# Altium project uz_per_current_measurement_dsub_to_rj45.PrjPcb
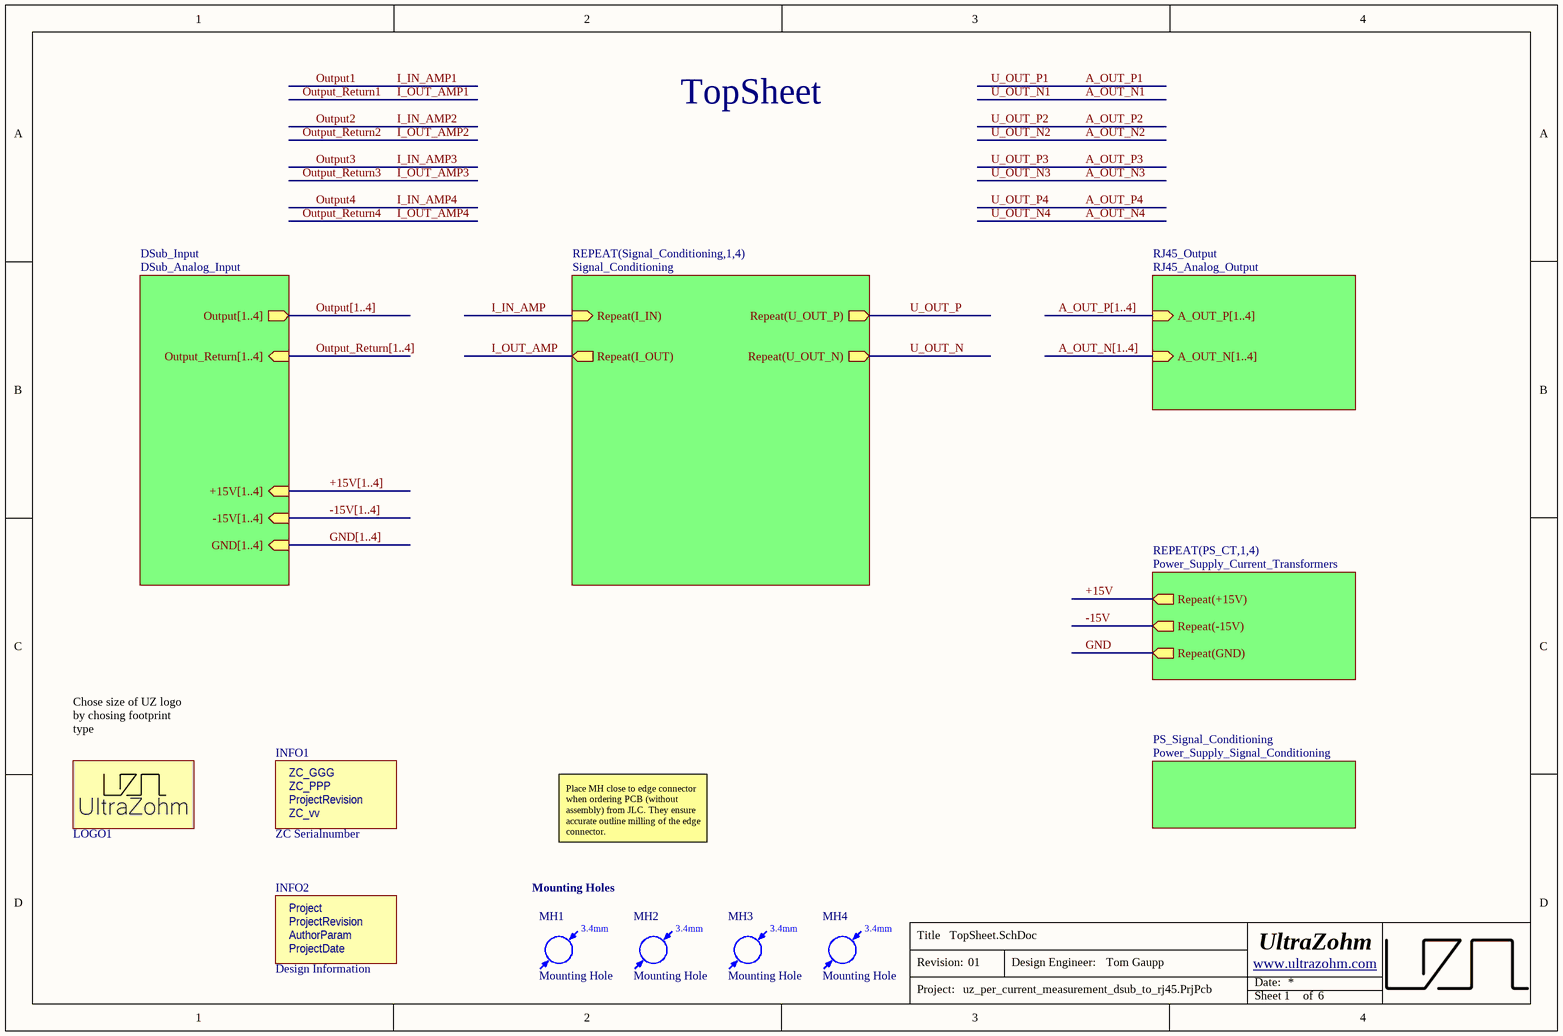
[diagram p0: TopSheet.SchDoc]
AuthorParam: Tom Gaupp; Project: uz_per_current_measurement_dsub_to_rj45; ProjectDate: 04/26; ProjectRevision: 01; ZC_GGG: 004; ZC_PPP: 008; ZC_vv: 00
6 sheets, 107 parts. Net scope: hierarchical (ports join the sheet entries above them; power ports are global).
Board file: uz_per_current_measurement_dsub_to_rj45.PcbDoc
Sheets:
  TopSheet.SchDoc
    Signal_Conditioning1 = Signal_Conditioning.SchDoc
    Signal_Conditioning2 = Signal_Conditioning.SchDoc
    Signal_Conditioning3 = Signal_Conditioning.SchDoc
    Signal_Conditioning4 = Signal_Conditioning.SchDoc
    DSub_Input = DSub_Analog_Input.SchDoc
    RJ45_Output = RJ45_Analog_Output.SchDoc
    PS_Signal_Conditioning = Power_Supply_Signal_Conditioning.SchDoc
    PS_CT1 = Power_Supply_Current_Transformers.SchDoc
    PS_CT2 = Power_Supply_Current_Transformers.SchDoc
    PS_CT3 = Power_Supply_Current_Transformers.SchDoc
    PS_CT4 = Power_Supply_Current_Transformers.SchDoc

## Sheet TopSheet.SchDoc
size A4; Author: Tom Gaupp; CompanyName: Zohm Control; Organization: UltraZohm; Address1: Kesslerplatz 12; Address2: 90489 Nürnberg; Address3: GERMANY; Revision: 1; SheetNumber: 1; SheetTotal: 6; Website: www.ultrazohm.com

### Parts
INFO1  ZC Serialnumber  [ZC-Serial]  (no BOM)
INFO2  Design Information  [Design_info]  (no BOM)
LOGO1  UZ Logo  [UZ_Logo_small]  (value not drawn)  (no BOM)
MH1  Mounting Hole  [MH_3.4]  (no BOM)
MH2  Mounting Hole  [MH_3.4]  (no BOM)
MH3  Mounting Hole  [MH_3.4]  (no BOM)
MH4  Mounting Hole  [MH_3.4]  (no BOM)

### Sub-sheets
DSub_Input = DSub_Analog_Input: Output[1..4] (out), Output_Return[1..4] (in), +15V[1..4] (in), -15V[1..4] (in), GND[1..4] (in)
PS_Signal_Conditioning = Power_Supply_Signal_Conditioning: no entries
REPEAT(PS_CT,1,4) = Power_Supply_Current_Transformers: Repeat(+15V) (out), Repeat(-15V) (out), Repeat(GND) (out)
REPEAT(Signal_Conditioning,1,4) = Signal_Conditioning: Repeat(I_IN) (in), Repeat(I_OUT) (out), Repeat(U_OUT_P) (out), Repeat(U_OUT_N) (out)
RJ45_Output = RJ45_Analog_Output: A_OUT_P[1..4] (in), A_OUT_N[1..4] (in)

### Nets
+15V: sheet REPEAT(PS_CT,1,4)/Repeat(+15V)
-15V: sheet REPEAT(PS_CT,1,4)/Repeat(-15V)
GND: sheet REPEAT(PS_CT,1,4)/Repeat(GND)
I_IN_AMP: sheet REPEAT(Signal_Conditioning,1,4)/Repeat(I_IN)
I_OUT_AMP: sheet REPEAT(Signal_Conditioning,1,4)/Repeat(I_OUT)
U_OUT_N: sheet REPEAT(Signal_Conditioning,1,4)/Repeat(U_OUT_N)
U_OUT_P: sheet REPEAT(Signal_Conditioning,1,4)/Repeat(U_OUT_P)

### Buses and harness runs
bus +15V[1..4] = sheet DSub_Input/+15V[1..4]
bus -15V[1..4] = sheet DSub_Input/-15V[1..4]
bus A_OUT_N[1..4] = sheet RJ45_Output/A_OUT_N[1..4]
bus A_OUT_P[1..4] = sheet RJ45_Output/A_OUT_P[1..4]
bus GND[1..4] = sheet DSub_Input/GND[1..4]
bus Output[1..4] = sheet DSub_Input/Output[1..4]
bus Output_Return[1..4] = sheet DSub_Input/Output_Return[1..4]

### Notes on the sheet
- TopSheet
- (near LOGO1) Chose size of UZ logo by chosing footprint type
- Place MH close to edge connector when ordering PCB (without assembly) from JLC. They ensure accurate outline milling of the edge connector.
- Mounting Holes
- Title
- Revision:
- Design Engineer:
- Date:
- Project:
- Sheet
- of
- (in symbol Design Information) Project; ProjectRevision; AuthorParam; ProjectDate
- (in symbol Mounting Hole) 3.4mm
- (in symbol ZC-Serial) ZC_GGG; ZC_PPP; ProjectRevision; ZC_vv

### Library data of the parts
INFO1 = ZC-Serial: Manufacturer: UltraZohm; Value: GGG-PPP-VVvv; Created from: FRosner; Manufacturer Part Number: ZC-Serial; PartID: 58; Created On: 15/04/2025 09:17:14; ComponentLink1Description: https://docs.ultrazohm.com/; ComponentLink1URL: homepage; Component Type: ZC Serialnumber; Last Updated: 15/04/2025 09:17:14; Supplier 1: -; Supplier Part Number 1: -; Type: Serial Number; Live Cycle Status: 1
INFO2 = Design Information: Manufacturer: UltraZohm; Created from: MGremer; Manufacturer Part Number: Design Information; PartID: 12; Created On: 03/11/2021 09:04:23; ComponentLink1Description: https://docs.ultrazohm.com/; ComponentLink1URL: homepage; Component Type: Design Information; Last Updated: 15/04/2025 09:29:36; Supplier 1: -; Supplier Part Number 1: -; Type: Design Information; Value: Design Information; Live Cycle Status: 1
LOGO1 = 1: Official Project Logo of the UltraZohm; Manufacturer: PCB Manufacturer; Manufacturer Part Number: UltraZohm Logo; Created from: T. Wendt; PartID: 1; Created On: 19.02.2021 16:55:56; ComponentLink1Description: Homepage; ComponentLink1URL: https://ultrazohm.com; Component Type: Logo; Last Updated: 02.03.2021 14:31:24; Type: Standard (No BOM); Live Cycle Status: 1
MH1-MH4 = Mounting Hole: Created from: MHlatky; Manufacturer Part Number: Mounting Hole; PartID: 16; Created On: 26/01/2021 09:19:51; ComponentLink1Description: Datasheet; Component Type: Mounting Hole; Device Package: -; Last Updated: 21/03/2022 23:05:12; Manufacturer: Mounting Hole; Supplier 1: Mounting Hole; Supplier Part Number 1: Mounting Hole; Type: Mounting Hole; Value: Mounting Hole; Live Cycle Status: 1; Stock number: not stored

## Sheet Signal_Conditioning.SchDoc
size A4; Author: Tom Gaupp; CompanyName: Technische Hochschule Nürnberg Georg Simon Ohm; Organization: UltraZohm; Address1: Kesslerplatz 12; Address2: 90489 Nürnberg; Address3: GERMANY; SheetNumber: 2; SheetTotal: 6; Website: www.ultrazohm.com
Used 4 times, as channels Signal_Conditioning1, Signal_Conditioning2, Signal_Conditioning3, Signal_Conditioning4. Parts and nets are listed once, with the designators drawn on the sheet.
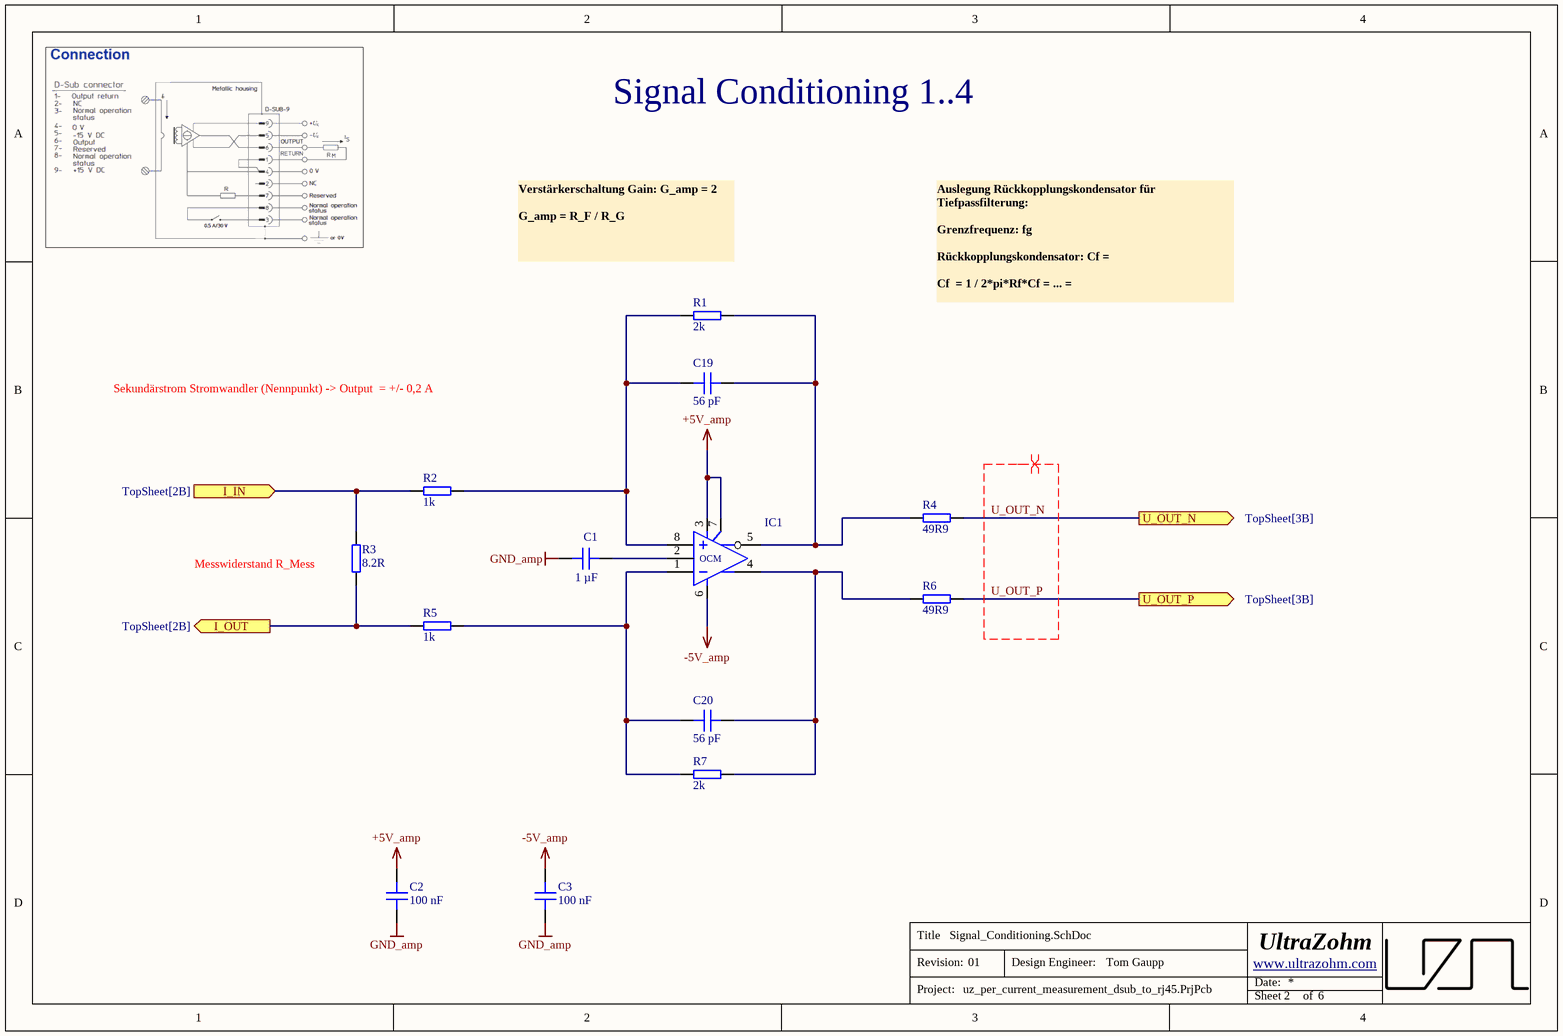
[diagram p1: Signal_Conditioning.SchDoc]

### Parts
C1  1 µF  [C_0603]
C2  100 nF  [C_0603]
C3  100 nF  [C_0603]
C19  56 pF  [C_0603]
C20  56 pF  [C_0603]
IC1  ADA4940-1ARZ-R7  [SOIC-8-N]  (value not drawn)
R1  2k  [RES 1206_3216]
R2  1k  [RES 1206_3216]
R3  8.2R  [RES 2010_5025]
R4  49R9  [RES 0603_1608]
R5  1k  [RES 1206_3216]
R6  49R9  [RES 0603_1608]
R7  2k  [RES 1206_3216]

### Ports
I_IN (in, see TopSheet[2B]), I_OUT (out, see TopSheet[2B]), U_OUT_N (out, see TopSheet[3B]), U_OUT_P (out, see TopSheet[3B])

### Nets
+5V_amp: C2.2 IC1.3(V+) IC1.7(EN)
-5V_amp: C3.2 IC1.6(V-)
GND_amp: C1.1 C2.1 C3.1
I_IN: R2.1 R3.2 ; port I_IN
I_OUT: R3.1 R5.1 ; port I_OUT
U_OUT_N: R4.2 ; port U_OUT_N
U_OUT_P: R6.2 ; port U_OUT_P
NetC1_2: C1.2 IC1.2(OCM)
NetC19_1: C19.1 IC1.8(+) R1.1 R2.2
NetC19_2: C19.2 IC1.5(Out) R1.2 R4.1
NetC20_1: C20.1 IC1.1(-) R5.2 R7.1
NetC20_2: C20.2 IC1.4(Out) R6.1 R7.2

### Channels
Signal_Conditioning1: designators C1=C1_Signal_Conditioning1 C2=C2_A C3=C3_A C19=C19_Signal_Conditioning1 C20=C20_Signal_Conditioning1 IC1=IC1_Signal_Conditioning1 R1=R1_Signal_Conditioning1 R2=R2_Signal_Conditioning1 R3=R3_A R4=R4_Signal_Conditioning1 R5=R5_Signal_Conditioning1 R6=R6_Signal_Conditioning1 R7=R7_Signal_Conditioning1; ports I_IN=I_IN_AMP1 I_OUT=I_OUT_AMP1 U_OUT_N=A_OUT_N1 U_OUT_P=A_OUT_P1
Signal_Conditioning2: designators C1=C1_Signal_Conditioning2 C2=C2_B C3=C3_B C19=C19_Signal_Conditioning2 C20=C20_Signal_Conditioning2 IC1=IC1_Signal_Conditioning2 R1=R1_Signal_Conditioning2 R2=R2_Signal_Conditioning2 R3=R3_B R4=R4_Signal_Conditioning2 R5=R5_Signal_Conditioning2 R6=R6_Signal_Conditioning2 R7=R7_Signal_Conditioning2; ports I_IN=I_IN_AMP2 I_OUT=I_OUT_AMP2 U_OUT_N=A_OUT_N2 U_OUT_P=A_OUT_P2
Signal_Conditioning3: designators C1=C1_Signal_Conditioning3 C2=C2_C C3=C3_C C19=C19_Signal_Conditioning3 C20=C20_Signal_Conditioning3 IC1=IC1_Signal_Conditioning3 R1=R1_Signal_Conditioning3 R2=R2_Signal_Conditioning3 R3=R3_C R4=R4_Signal_Conditioning3 R5=R5_Signal_Conditioning3 R6=R6_Signal_Conditioning3 R7=R7_Signal_Conditioning3; ports I_IN=I_IN_AMP3 I_OUT=I_OUT_AMP3 U_OUT_N=A_OUT_N3 U_OUT_P=A_OUT_P3
Signal_Conditioning4: designators C1=C1_Signal_Conditioning4 C2=C2_D C3=C3_D C19=C19_Signal_Conditioning4 C20=C20_Signal_Conditioning4 IC1=IC1_Signal_Conditioning4 R1=R1_Signal_Conditioning4 R2=R2_Signal_Conditioning4 R3=R3_D R4=R4_Signal_Conditioning4 R5=R5_Signal_Conditioning4 R6=R6_Signal_Conditioning4 R7=R7_Signal_Conditioning4; ports I_IN=I_IN_AMP4 I_OUT=I_OUT_AMP4 U_OUT_N=A_OUT_N4 U_OUT_P=A_OUT_P4

### Layout directives
differential pair: U_OUT_N, U_OUT_P

### Notes on the sheet
- Signal Conditioning 1..4
- Verstärkerschaltung Gain: G_amp = 2
  G_amp = R_F / R_G
- Auslegung Rückkopplungskondensator für Tiefpassfilterung:
  Grenzfrequenz: fg
  Rückkopplungskondensator: Cf =
  Cf  = 1 / 2*pi*Rf*Cf = ... =
- Sekundärstrom Stromwandler (Nennpunkt) -> Output  = +/- 0,2 A
- (near R3) Messwiderstand R_Mess
- Title
- Revision:
- Design Engineer:
- Date:
- Project:
- Sheet
- of

### Library data of the parts
C1 = CL10A105KB8NNNC: 50V 1uF X5R ±10% 0603  Multilayer Ceramic Capacitors MLCC - SMD/SMT ROHS; Manufacturer: Samsung Electro-Mechanics; Voltage Rating: 50 VDC; Created from: MGremer; Supplier 1: LCSC; Supplier Part Number 1: C15849; Manufacturer Part Number: CL10A105KB8NNNC; Value: 1 µF; PartID: 5; Created On: 20/12/2020 13:54:13; ComponentLink1Description: Datasheet; ComponentLink1URL: https://datasheet.lcsc.com/lcsc/1810261812_Samsung-Electro-Mechanics-CL10A105KB8NNNC_C15849.pdf; Component Type: Capacitor 0603; Device Package: 0603; Last Updated: 28/11/2022 17:23:01; Mounting Type: SMD; Operating Temperature: -55 - 85°C; Series: M; Type: Capacitor; Tolerance: 10 %; Live Cycle Status: 1; LCSC Part Number: C15849; Stock number: Labor SMD Container
C2 C3 = C0603C104K5RAC3121: Capacitor 0603, 50 VDC, 100nF, X7R; Manufacturer: KEMET; Tolerance: 10 %; Voltage Rating: 50 VDC; Created from: DHufnagel; Manufacturer Part Number: C0603C104K5RAC3121; PartID: 99; Created On: 11/08/2022 14:33:29; ComponentLink1Description: Datasheet; ComponentLink1URL: https://www.mouser.de/datasheet/2/212/KEM_C1023_X7R_AUTO_SMD-1093309.pdf; Component Type: Capacitor 0603; Device Package: 0603; Last Updated: 19/08/2022 08:26:58; Mounting Type: SMD; Operating Temperature: -55 - 125°C; Series: X7R; Supplier 1: Mouser; Supplier Part Number 1: 80-C603C104K5RAC3121; Supplier 2: LCSC; Supplier Part Number 2: C696358; Type: Capacitor; Value: 100 nF; Live Cycle Status: 1; LCSC Part Number: C696358; Stock number: not stored
C19 C20 = CL10C560JB8NNNC: Capacitor 0603, 50 VDC, 56 pF, C0G; Manufacturer: Samsung Electro-Mechanics; Tolerance: 5 %; Voltage Rating: 50 VDC; Created from: DHufnagel; Manufacturer Part Number: CL10C560JB8NNNC; PartID: 92; Created On: 20/12/2020 13:54:13; ComponentLink1Description: Datasheet; ComponentLink1URL: https://www.mouser.de/datasheet/2/585/MLCC-1837944.pdf; Component Type: Capacitor 0603; Device Package: 0603; Last Updated: 20/12/2020 16:24:16; Mounting Type: SMD; Operating Temperature: -55 - 125°C; Series: CL; Supplier 1: Mouser; Supplier Part Number 1: 187-CL10C560JB8NNNC; Supplier 2: LCSC; Supplier Part Number 2: C39148; Type: Capacitor; Value: 56 pF; Live Cycle Status: 1; LCSC Part Number: C39148; Stock number: not stored
IC1 = ADA4940-1ARZ-R7: Differential ADC Driver; Manufacturer: Analog Devices; Class I: Analog; Class II: Fully Differential ADC Drivers (-40-125°C); Best.-Nr.: Farnell 209-6178; Channels: 1; Created from: MGremer; Datasheet: DSO11449, Ver. Aug 2000; Last edited: 04.01.2007 10:14; Package Reference: SOIC-N-8; Manufacturer Part Number: ADA4940-1ARZ-R7; PartID: 3; Created On: 15/01/2021 12:16:53; ComponentLink1Description: Datasheet; ComponentLink1URL: https://www.mouser.de/datasheet/2/609/ADA4940-1_4940-2-878284.pdf; Component Type: ADC; Device Package: SOIC-8; Last Updated: 17/02/2026 13:51:19; Mounting Type: SMD; Operating Temperature: -40 - 105 °C; Supplier 1: Mouser; Supplier Part Number 1: 584-ADA4940-1ARZ-R7; Supplier 2: LCSC; Supplier Part Number 2: C730049; Type: ADC; Resolution: -; Value: differential ADC driver; Live Cycle Status: 1; LCSC Part Number: C730049; Stock number: not stored
R1 R7 = ERA-8AEB202V: 2kΩ ±0.1% 250mW 1206; Manufacturer: Panasonic; Created from: TGaupp; Manufacturer Part Number: ERA-8AEB202V; PartID: 384; Created On: 17/02/2026 13:38:22; ComponentLink1Description: Datasheet; ComponentLink1URL: https://www.lcsc.com/datasheet/C2073471.pdf; Component Type: SMD resistor; Device Package: 1206; Last Updated: 17/02/2026 13:39:41; Mounting Type: SMD; Supplier 1: Mouser; Supplier Part Number 1: 667-ERA-8AEB202V; Supplier 2: LCSC; Supplier Part Number 2: C2073471; Type: Resistor; Tolerance: 0.1%; Value: 2k; Live Cycle Status: 1; Stock number: not stored; LCSC Part Number: C2073471
R2 R5 = ERA-8AEB102V: SMD resistor 1/4W 1.0Kohm 0.1% 25ppm; Manufacturer: Panasonic; Created from: TGaupp; Manufacturer Part Number: ERA-8AEB102V; PartID: 292; Created On: 08/08/2023 13:03:51; ComponentLink1Description: Datasheet; ComponentLink1URL: https://www.mouser.de/datasheet/2/315/AOA0000C307-1149632.pdf; Component Type: SMD resistor; Device Package: 1206; Last Updated: 17/02/2026 13:14:39; Mounting Type: SMD; Supplier 1: Mouser; Supplier Part Number 1: 667-ERA-8AEB102V; Type: Resistor; Tolerance: 0.1%; Value: 1k; Live Cycle Status: 1; Stock number: not stored; LCSC Part Number: C491153
R3 = RC2010FK-078R2L: -55℃~+155℃ 200V 750mW 8.2Ω Thick Film Resistor ±1% ±200ppm/℃ 2010 Chip Resistor; Manufacturer: YAEGO; Created from: TGaupp; Manufacturer Part Number: RC2010FK-078R2L; PartID: 393; Created On: 03/06/2026 12:29:37; ComponentLink1Description: Datasheet; ComponentLink1URL: https://www.lcsc.com/datasheet/C877647.pdf?spm=wm.sxq.inf.ggs___wm.fly.bg.1.xh&lcsc_vid=QQAPVAECQgdWVlZeR1YKVFcAFllaVVcHTlRZAgUCQFkxVlNeR1VZUlNUTlJbUDsOAxUeFF5JWBYZEEoKFBINSQcJGk4eFQsCAgIaSgADAwAHC0slTldYV1ZfWQkaCgg%3D; Component Type: SMD resistor; Device Package: 2010; Last Updated: 03/06/2026 13:37:55; Mounting Type: SMD; Supplier 1: LCSC; Supplier Part Number 1: C877647; Type: Resistor; Tolerance: 1%; Value: 8.2R; Live Cycle Status: 1; LCSC Part Number: C877647
R4 R6 = RC0603FR-0749R9L: 100mW Thick Film Resistors ±100ppm/℃ ±1% 49.9Ω 0603 Chip Resistor - Surface Mount ROHS; Manufacturer: YAGEO; Created from: AGeiger; Manufacturer Part Number: RC0603FR-0749R9L; PartID: 277; Created On: 14.06.2023 17:42:26; ComponentLink1Description: Datasheet; ComponentLink1URL: https://datasheet.lcsc.com/lcsc/2304140030_YAGEO-RC0603FR-0749R9L_C114625.pdf; Component Type: SMD resistor; Device Package: 0603; Last Updated: 14.06.2023 17:42:26; Mounting Type: SMD; Type: Resistor; Tolerance: 1%; Value: 49R9; Live Cycle Status: 1; LCSC Part Number: C114625; Supplier 1: Mouser; Supplier Part Number 1: 603-RC0402FR-0749R9L

## Sheet DSub_Analog_Input.SchDoc
size A4; Author: Tom Gaupp; CompanyName: Technische Hochschule Nürnberg Georg Simon Ohm; Organization: UltraZohm; Address1: Kesslerplatz 12; Address2: 90489 Nürnberg; Address3: GERMANY; SheetNumber: 3; SheetTotal: 6; Website: www.ultrazohm.com
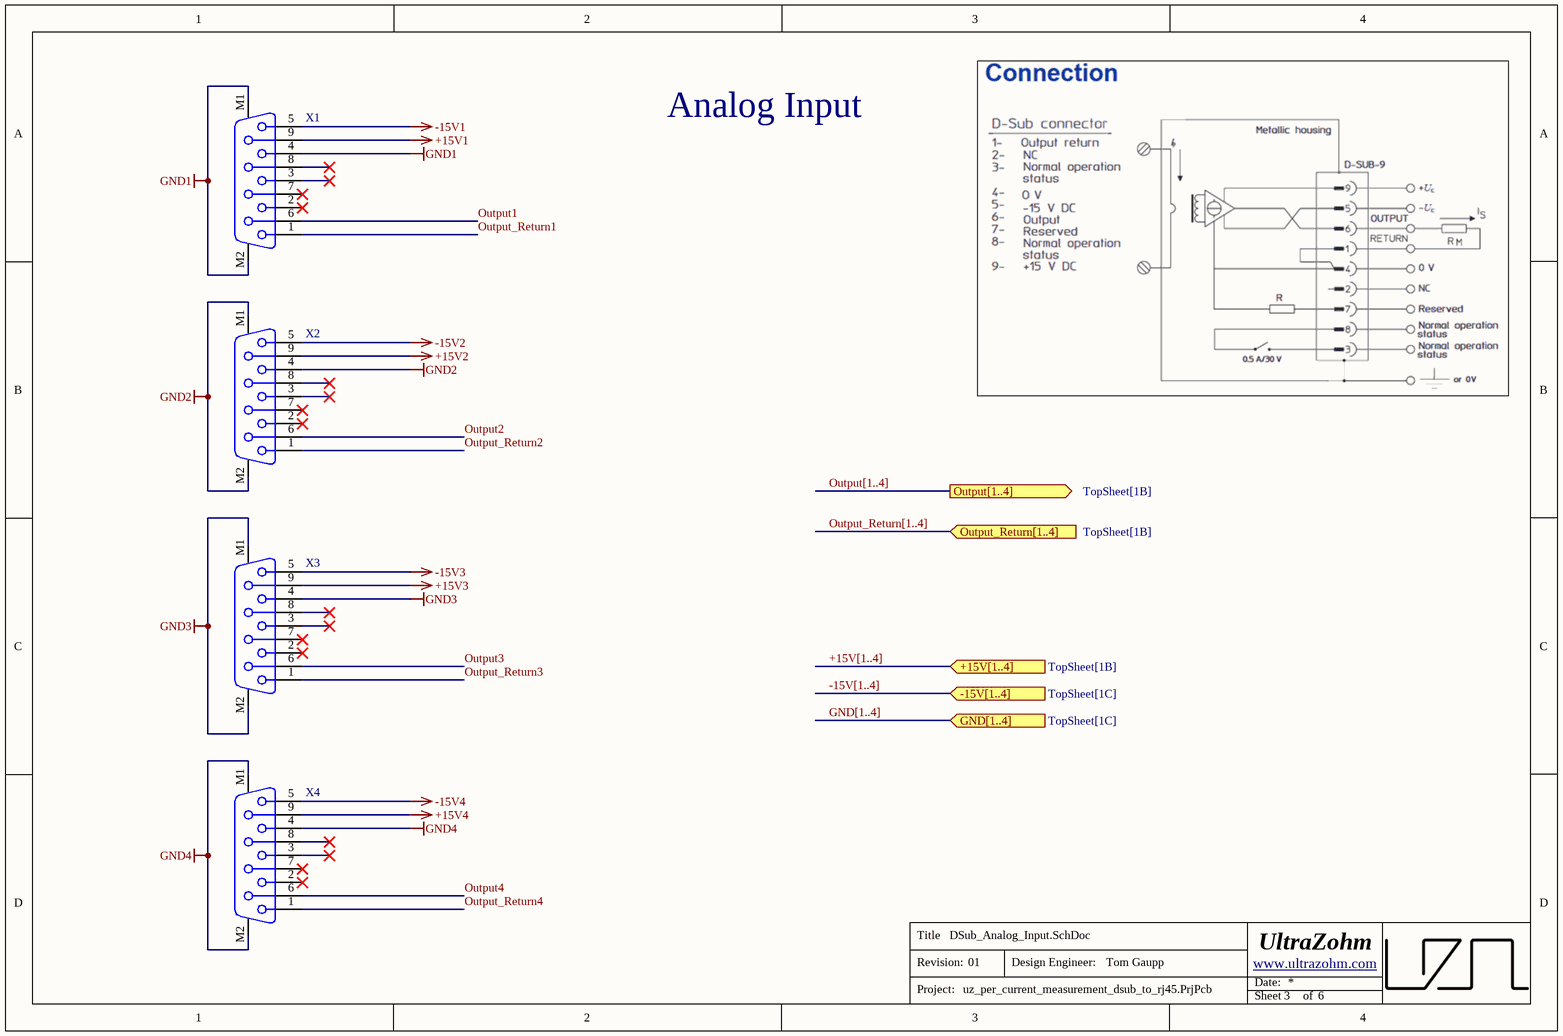
[diagram p2: DSub_Analog_Input.SchDoc]

### Parts
X1  D-SUB 9, female  [618009231121]  (value not drawn)
X2  D-SUB 9, female  [618009231121]  (value not drawn)
X3  D-SUB 9, female  [618009231121]  (value not drawn)
X4  D-SUB 9, female  [618009231121]  (value not drawn)

### Ports
+15V[1..4] (in, see TopSheet[1B]), -15V[1..4] (in, see TopSheet[1C]), GND[1..4] (in, see TopSheet[1C]), Output[1..4] (out, see TopSheet[1B]), Output_Return[1..4] (in, see TopSheet[1B])

### Nets
+15V1: X1.9
+15V2: X2.9
+15V3: X3.9
+15V4: X4.9
-15V1: X1.5
-15V2: X2.5
-15V3: X3.5
-15V4: X4.5
GND1: X1.4 X1.M1 X1.M2
GND2: X2.4 X2.M1 X2.M2
GND3: X3.4 X3.M1 X3.M2
GND4: X4.4 X4.M1 X4.M2
Output1: X1.6  [project net I_IN_AMP1]
Output2: X2.6  [project net I_IN_AMP2]
Output3: X3.6  [project net I_IN_AMP3]
Output4: X4.6  [project net I_IN_AMP4]
Output_Return1: X1.1  [project net I_OUT_AMP1]
Output_Return2: X2.1  [project net I_OUT_AMP2]
Output_Return3: X3.1  [project net I_OUT_AMP3]
Output_Return4: X4.1  [project net I_OUT_AMP4]

Not connected (* = marked no-connect by the designer): X1 2* 3* 7* 8*; X2 2* 3* 7* 8*; X3 2* 3* 7* 8*; X4 2* 3* 7* 8*

### Buses and harness runs
bus +15V[1..4] = port +15V[1..4]
bus -15V[1..4] = port -15V[1..4]
bus GND[1..4] = port GND[1..4]
bus Output[1..4] = port Output[1..4]
bus Output_Return[1..4] = port Output_Return[1..4]

### Notes on the sheet
- Analog Input
- Title
- Revision:
- Design Engineer:
- Date:
- Project:
- Sheet
- of

### Library data of the parts
X1-X4 = 618009231121: D-Sub Standard Connectors WR-DSUB Female PCB 9Pin Hex Scrw 8.08mm; Manufacturer: Wuerth Elektronik; Contact Resistance: 30mOhm; Rated Current: 3A; Working Voltage: 125VAC; Withstanding Voltage: 1000VAC; Created from: AGeiger; Manufacturer Part Number: 618009231121; Category: Input/Output Connectors; Match Code: WR-DSUB; ComponentLink1Description: Datasheet; ComponentLink1URL: https://www.we-online.com/components/products/datasheet/618009231121.pdf; ComponentLink2Description: Datasheet Link; ComponentLink2URL: https://www.we-online.com/redexpert/spec/618009231121?ad; Mount: Through Hole; Operating Temperature Max: 105°C; Operating Temperature Min: -55°C; Packaging: Tray; Gender: Female; Number of Pins: 9; Orientation: Angled; PartID: 6; Created On: 31/05/2023 13:23:16; Last Updated: 31/05/2023 13:23:16; Mounting Type: THT; Operating Temperature: -40 °C to +85 °C; Series: D-SUB Standard; Supplier 1: Mouser; Supplier Part Number 1: 710-618009231121; Value: D-SUB 9, female; LCSC Part Number: C141882

## Sheet RJ45_Analog_Output.SchDoc
size A4; Author: Tom Gaupp; CompanyName: Technische Hochschule Nürnberg Georg Simon Ohm; Organization: UltraZohm; Address1: Kesslerplatz 12; Address2: 90489 Nürnberg; Address3: GERMANY; SheetNumber: 4; SheetTotal: 6; Website: www.ultrazohm.com
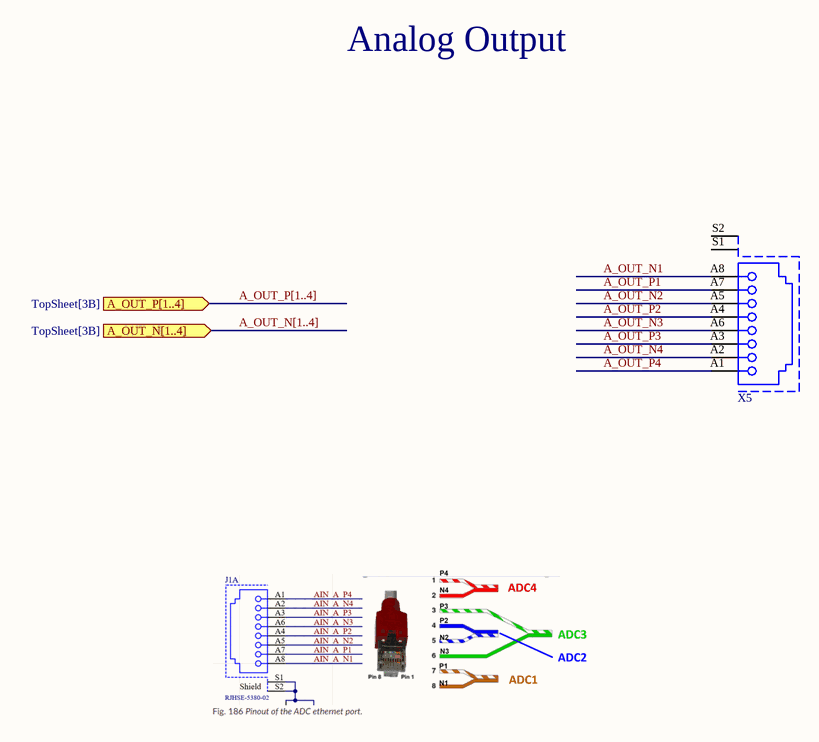
[diagram p3: RJ45_Analog_Output.SchDoc]

### Parts
X5  (no value)  [R-RJ45R10P-B000]

### Ports
A_OUT_N[1..4] (in, see TopSheet[3B]), A_OUT_P[1..4] (in, see TopSheet[3B])

### Nets
A_OUT_N1: X5.A8
A_OUT_N2: X5.A5
A_OUT_N3: X5.A6
A_OUT_N4: X5.A2
A_OUT_P1: X5.A7
A_OUT_P2: X5.A4
A_OUT_P3: X5.A3
A_OUT_P4: X5.A1

Not connected (* = marked no-connect by the designer): X5 S1 S2

### Buses and harness runs
bus A_OUT_N[1..4] = port A_OUT_N[1..4]
bus A_OUT_P[1..4] = port A_OUT_P[1..4]

### Notes on the sheet
- Analog Output
- Title
- Revision:
- Design Engineer:
- Date:
- Project:
- Sheet
- of

### Library data of the parts
X5 = R-RJ45R10P-B000: RJ45Receptacle 1 Shielded Bend insert Without LED 0℃~+70℃ Plugin Ethernet Connectors / Modular Connectors (RJ45 RJ11) ROHS; Manufacturer: Ckmtw(Shenzhen Cankemeng); Created from: KIlhan; Manufacturer Part Number: R-RJ45R10P-B000; PartID: 57; Created On: 20/03/2025 09:19:07; ComponentLink1Description: Datasheet; ComponentLink1URL: https://jlcpcb.com/api/file/downloadByFileSystemAccessId/8588892085580021760; Last Updated: 18/05/2025 18:44:47; Mounting Type: THT; Operating Temperature: 0 °C to +70 °C; Series: RJ45; Supplier 1: LCSC; Supplier Part Number 1: C386758; Value: R-RJ45R10P-B000; LCSC Part Number: C386758

## Sheet Power_Supply_Signal_Conditioning.SchDoc
size A4; Author: Tom Gaupp; CompanyName: Technische Hochschule Nürnberg Georg Simon Ohm; Organization: UltraZohm; Address1: Kesslerplatz 12; Address2: 90489 Nürnberg; Address3: GERMANY; SheetNumber: 5; SheetTotal: 6; Website: www.ultrazohm.com
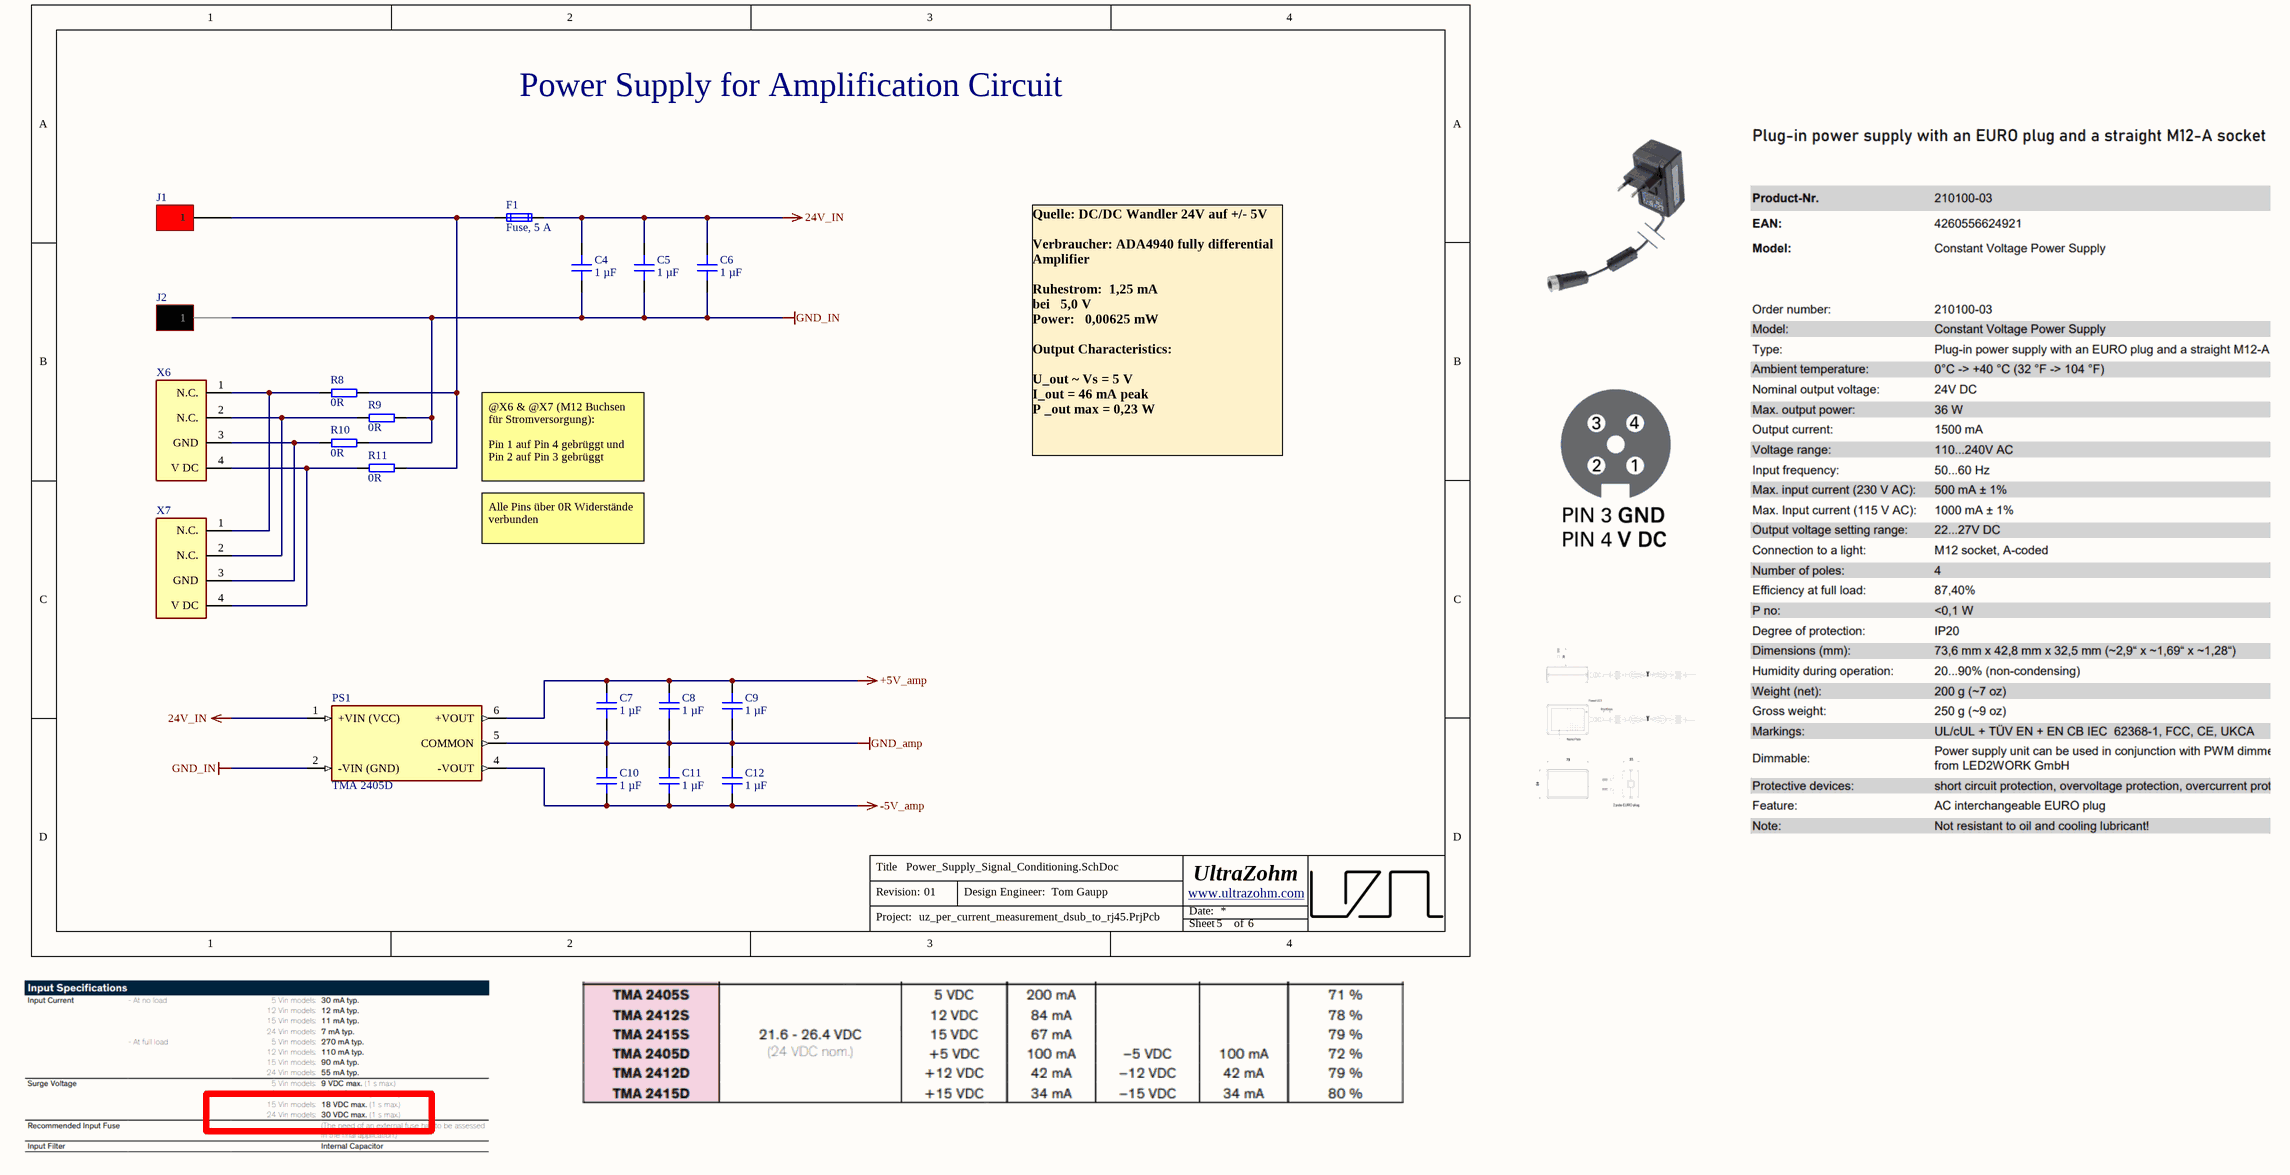
[diagram p4: Power_Supply_Signal_Conditioning.SchDoc]

### Parts
C4  1 µF  [C_0603]
C5  1 µF  [C_0603]
C6  1 µF  [C_0603]
C7  1 µF  [C_0603]
C8  1 µF  [C_0603]
C9  1 µF  [C_0603]
C10  1 µF  [C_0603]
C11  1 µF  [C_0603]
C12  1 µF  [C_0603]
F1  Fuse, 5 A  [0154xxx]
J1  FCR7350R, PCB mount 4mm jack, RED  [FCR7350]  (value not drawn)
J2  FCR7350B, PCB mount 4mm jack, BLACK  [FCR7350]  (value not drawn)
PS1  TMA 2405D  [SIP7]
R8  0R  [RES 1206_3216]
R9  0R  [RES 1206_3216]
R10  0R  [RES 1206_3216]
R11  0R  [RES 1206_3216]
X6  CAZN_M12-P4A-GPL_M12  [CAZN_M12-P4A-GPL_M12]  (value not drawn)
X7  CAZN_M12-P4A-GPL_M12  [CAZN_M12-P4A-GPL_M12]  (value not drawn)

### Nets
24V_IN: C4.1 C5.1 C6.1 F1.2 PS1.1(+VIN_(VCC))
+5V_amp: C7.2 C8.2 C9.2 PS1.6(+VOUT)
-5V_amp: C10.1 C11.1 C12.1 PS1.4(-VOUT)
GND_amp: C7.1 C8.1 C9.1 C10.2 C11.2 C12.2 PS1.5(COMMON)
GND_IN: C4.2 C5.2 C6.2 J2.1 PS1.2(-VIN_(GND)) R9.2 R10.2
NetF1_1: F1.1 J1.1 R8.2 R11.2
NetR8_1: R8.1 X6.1(N.C.) X7.1(N.C.)
NetR9_1: R9.1 X6.2(N.C.) X7.2(N.C.)
NetR10_1: R10.1 X6.3(GND) X7.3(GND)
NetR11_1: R11.1 X6.4(V_DC) X7.4(V_DC)

### Notes on the sheet
- Power Supply for Amplification Circuit
- @X6 & @X7 (M12 Buchsen für Stromversorgung):
  Pin 1 auf Pin 4 gebrüggt und
  Pin 2 auf Pin 3 gebrüggt
- Quelle: DC/DC Wandler 24V auf +/- 5V
  Verbraucher: ADA4940 fully differential Amplifier
  Ruhestrom: 	1,25 mA
  bei 		5,0 V
  Power: 		0,00625 mW
  Output Characteristics:
  U_out ~ Vs = 5 V
  I_out = 46 mA peak
  P _out max = 0,23 W
- Alle Pins über 0R Widerstände verbunden
- Title
- Revision:
- Design Engineer:
- Date:
- Project:
- Sheet
- of

### Library data of the parts
C4-C12 = CL10A105KB8NNNC: as C1 on sheet Signal_Conditioning; Supplier 1: LCSC; Supplier Part Number 1: C15849; Manufacturer Part Number: CL10A105KB8NNNC; Value: 1 µF; PartID: 5; ComponentLink1Description: Datasheet; ComponentLink1URL: https://datasheet.lcsc.com/lcsc/1810261812_Samsung-Electro-Mechanics-CL10A105KB8NNNC_C15849.pdf; Component Type: Capacitor 0603; Device Package: 0603; Mounting Type: SMD; Operating Temperature: -55 - 85°C; Series: M; Type: Capacitor; Tolerance: 10 %; Live Cycle Status: 1; LCSC Part Number: C15849; Stock number: Labor SMD Container
  C4 C5 C7-C12: Created On: 20.12.2020 13:54:13; Last Updated: 28.11.2022 17:23:01
  C6: Created On: 20/12/2020 13:54:13; Last Updated: 28/11/2022 17:23:01
F1 = 0154005.DR: Fuse OMNI BLOK 154; Manufacturer: Littlefuse; Nominal current: 5 A; Nominal voltage AC: 125 VAC; Nominal voltage DC: 125 VDC; Resistance: 12.5 mOhm; Created from: MGremer; Manufacturer Part Number: 0154005.DR; PartID: 1; Created On: 07/01/2021 10:17:19; ComponentLink1Description: Datasheet; ComponentLink1URL: https://www.mouser.de/datasheet/2/240/Littelfuse_Fuse_154_154T_154L_154TL_Datasheet_pdf-365375.pdf; Component Type: NAN02 - 154 OMNI-BLOK; Device Package: OMNI-BLOK; Last Updated: 12/08/2025 20:50:24; Mounting Type: SMD; Operating Temperature: -55 - 125 °C; Series: 154; Supplier 1: Mouser; Supplier Part Number 1: 576-0154005.DR; Supplier 2: LCSC; Supplier Part Number 2: C206916; Type: Fuse; Value: Fuse, 5 A; Live Cycle Status: 1; LCSC Part Number: C206916
J1 = FCR7350R: FCR7350B, 1000V, 24A, RED; Manufacturer: Cliff; Value: PCB mount 4mm jack, Red FCR7350R, 1000V, 24A; Created from: DHufnagel; Manufacturer Part Number: FCR7350R; PartID: 7; Created On: 13/06/2022 10:18:11; ComponentLink1Description: datasheet; ComponentLink1URL: https://www.cliffuk.co.uk/products/testleads/sockets/S16NPC.pdf; ComponentLink2Description: drawing; ComponentLink2URL: https://media.digikey.com/pdf/Data%20Sheets/Cliff%20Electronic%20LTD%20PDF's/FCR7350_Drawing.pdf; Component Type: PCB mount 4mm jack, Red; Device Package: THT; Last Updated: 21/02/2024 15:19:13; Minimum Order: 1; Mounting Type: THT; Operating Temperature: -40°C - 80°C; Series: S16N-PC; Supplier 1: Digi-Key; Supplier Part Number 1: 3185-FCR7350R-ND; Supplier 2: farnell; Supplier Part Number 2: 1854508; Supplier 3: LCSC; Supplier Part Number 3: C7437326; Type: PCB mount 4mm jack, Red FCR7350R, 1000V, 24A; Live Cycle Status: 1; LCSC Part Number: C7437326; Stock number: not stored
J2 = FCR7350B: FCR7350B, 1000V, 24A, BLACK; Manufacturer: Cliff; Value: PCB mount 4mm jack, Black	FCR7350B, 1000V, 24A; Created from: DHufnagel; Manufacturer Part Number: FCR7350B; PartID: 6; Created On: 13/06/2022 10:18:11; ComponentLink1Description: datasheet; ComponentLink1URL: https://www.cliffuk.co.uk/products/testleads/sockets/S16NPC.pdf; ComponentLink2Description: drawing; ComponentLink2URL: https://media.digikey.com/pdf/Data%20Sheets/Cliff%20Electronic%20LTD%20PDF's/FCR7350_Drawing.pdf; Component Type: PCB mount 4mm jack, Black; Device Package: THT; Last Updated: 21/02/2024 15:21:29; Minimum Order: 1; Mounting Type: THT; Operating Temperature: -40°C - 80°C; Series: S16N-PC; Supplier 1: Digi-Key; Supplier Part Number 1: 3185-FCR7350B-ND; Supplier 2: farnell; Supplier Part Number 2: 1854507; Supplier 3: LCSC; Supplier Part Number 3: C7437327; Type: PCB mount 4mm jack, Black	FCR7350B, 1000V, 24A; Live Cycle Status: 1; LCSC Part Number: C7437327; Stock number: not stored
PS1 = TMA 2405D: 22-26 V Input, +/- 5 V @100mA  Output, 1 W, isolated DC/DC-converter; Manufacturer: TRACO Power; Created from: TGaupp; Manufacturer Part Number: TMA 2405D; PartID: 21; Created On: 24/02/2026 14:55:36; ComponentLink1Description: Datasheet; ComponentLink1URL: https://www.lcsc.com/datasheet/C6285339.pdf; Component Type: Isolated DC/DC; Last Updated: 24/02/2026 15:06:39; Mounting Type: THT; Operating Temperature: -40 - 85 °C; Supplier 1: LCSC; Supplier Part Number 1: C6285339; Type: Isolated DC/DC; Live Cycle Status: 1; LCSC Part Number: C6285339; Stock number: not stored
R8-R11 = 1206W4F0000T5E: 250mW Thick Film Resistors ±800ppm/℃ ±1% 0Ω 1206 Chip Resistor - Surface Mount ROHS; Manufacturer: UNI-ROYAL; Created from: AGeiger; Manufacturer Part Number: 1206W4F0000T5E; PartID: 271; Created On: 06/06/2023 20:12:49; ComponentLink1Description: Datasheet; ComponentLink1URL: https://datasheet.lcsc.com/lcsc/2206010200_UNI-ROYAL-Uniroyal-Elec-1206W4F0000T5E_C17888.pdf; Component Type: SMD resistor; Device Package: 1206; Last Updated: 27/05/2026 08:49:04; Mounting Type: SMD; Supplier 1: LCSC; Supplier Part Number 1: C17888; Supplier 2: Mouser; Supplier Part Number 2: 303-1206W4F0000T5E; Type: Resistor; Tolerance: 1%; Value: 0R; Live Cycle Status: 1; LCSC Part Number: C17888
X6 X7 = CAZN_M12-P4A-GPL_M12: M12 Metric Circular Connector, A-Coded, Metal Non-shielded, 4A, 04 pins, Male Connector, Male Contact, Hexagonal, M12*1.0, Screw Thread, PCB 90°; Manufacturer: CAZN; Created from: TGaupp; Manufacturer Part Number: CAZN_M12-P4A-GPL_M12; PartID: 31; Created On: 03/06/2026 11:54:12; ComponentLink1Description: Datasheet; ComponentLink1URL: https://www.lcsc.com/datasheet/C19108992.pdf?spm=wm.sxq.inf.ggs___wm.fly.bg.0.xh&lcsc_vid=TwNaAlRSR1ldAVwCFFVbXlUCQQUIVQcDFgRYX1YFEwcxVlNeR1VZUFBQQ1RbXzsOAxUeFF5JWBYZEEoKFBINSQcJGk4eFQsCAgIaSgADAwAHC0slRVNfUVBSTlZADxALGw%3D%3D; Component Type: M12 A-Type 4 Pole Connector; Device Package: THT; Last Updated: 03/06/2026 13:55:49; Mounting Type: THT; Operating Temperature: -25℃ - 80 ℃; Supplier 1: LCSC; Supplier Part Number 1: C19108992; Type: M12 Connector; Live Cycle Status: 1; LCSC Part Number: C19108992; Stock number: not stored

## Sheet Power_Supply_Current_Transformers.SchDoc
size A4; Author: Tom Gaupp; CompanyName: Technische Hochschule Nürnberg Georg Simon Ohm; Organization: UltraZohm; Address1: Kesslerplatz 12; Address2: 90489 Nürnberg; Address3: GERMANY; SheetNumber: 6; SheetTotal: 6; Website: www.ultrazohm.com
Used 4 times, as channels PS_CT1, PS_CT2, PS_CT3, PS_CT4. Parts and nets are listed once, with the designators drawn on the sheet.
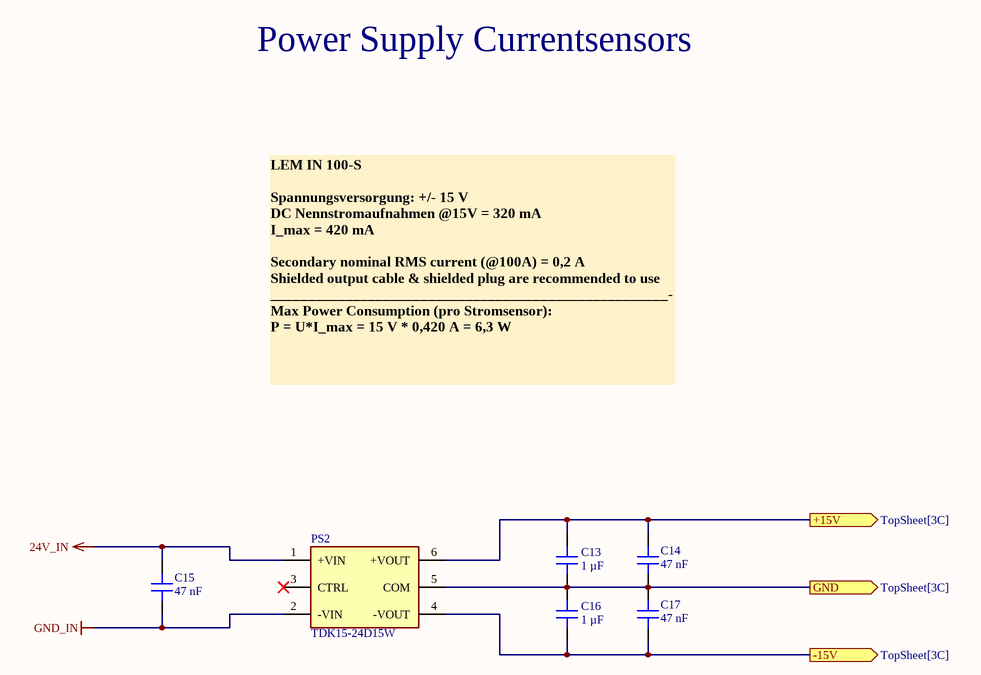
[diagram p5: Power_Supply_Current_Transformers.SchDoc]

### Parts
C13  1 µF  [C_0603]
C14  47 nF  [C_0603]
C15  47 nF  [C_0603]
C16  1 µF  [C_0603]
C17  47 nF  [C_0603]
PS2  TDK15-24D15W  [TDK15-24D15W]

### Ports
+15V (out, see TopSheet[3C]), -15V (out, see TopSheet[3C]), GND (out, see TopSheet[3C])

### Nets
24V_IN: C15.2 PS2.1(+VIN)
GND_IN: C15.1 PS2.2(-VIN)
+15V: C13.2 C14.2 PS2.6(+VOUT) ; port +15V
-15V: C16.1 C17.1 PS2.4(-VOUT) ; port -15V
GND: C13.1 C14.1 C16.2 C17.2 PS2.5(COM) ; port GND

Not connected (* = marked no-connect by the designer): PS2 3(CTRL)*

### Channels
PS_CT1: designators C13=C13_PS_CT1 C14=C14_A C15=C15_A C16=C16_PS_CT1 C17=C17_A PS2=PS2_A; ports +15V=+15V1 -15V=-15V1 GND=GND1
PS_CT2: designators C13=C13_PS_CT2 C14=C14_B C15=C15_B C16=C16_PS_CT2 C17=C17_B PS2=PS2_B; ports +15V=+15V2 -15V=-15V2 GND=GND2
PS_CT3: designators C13=C13_PS_CT3 C14=C14_C C15=C15_C C16=C16_PS_CT3 C17=C17_C PS2=PS2_C; ports +15V=+15V3 -15V=-15V3 GND=GND3
PS_CT4: designators C13=C13_PS_CT4 C14=C14_D C15=C15_D C16=C16_PS_CT4 C17=C17_D PS2=PS2_D; ports +15V=+15V4 -15V=-15V4 GND=GND4

### Notes on the sheet
- Power Supply Currentsensors
- LEM IN 100-S
  Spannungsversorgung: +/- 15 V
  DC Nennstromaufnahmen @15V = 320 mA
  I_max = 420 mA
  Secondary nominal RMS current (@100A) = 0,2 A
  Shielded output cable & shielded plug are recommended to use
  _____________________________________________________-
  Max Power Consumption (pro Stromsensor):
  P = U*I_max = 15 V * 0,420 A = 6,3 W
- Title
- Revision:
- Design Engineer:
- Date:
- Project:
- Sheet
- of

### Library data of the parts
C13 C16 = CL10A105KB8NNNC: as C1 on sheet Signal_Conditioning; Supplier 1: LCSC; Supplier Part Number 1: C15849; Manufacturer Part Number: CL10A105KB8NNNC; Value: 1 µF; PartID: 5; Created On: 20.12.2020 13:54:13; ComponentLink1Description: Datasheet; ComponentLink1URL: https://datasheet.lcsc.com/lcsc/1810261812_Samsung-Electro-Mechanics-CL10A105KB8NNNC_C15849.pdf; Component Type: Capacitor 0603; Device Package: 0603; Last Updated: 28.11.2022 17:23:01; Mounting Type: SMD; Operating Temperature: -55 - 85°C; Series: M; Type: Capacitor; Tolerance: 10 %; Live Cycle Status: 1; LCSC Part Number: C15849; Stock number: Labor SMD Container
C14 C15 C17 = CL10B473KB8NNNC: Capacitor 0603, 50 VDC, 47 nF, X7R; Manufacturer: Samsung Electro-Mechanics; Tolerance: 10 %; Voltage Rating: 50 VDC; Created from: DHufnagel; Manufacturer Part Number: CL10B473KB8NNNC; PartID: 97; Created On: 20/07/2022 09:55:05; ComponentLink1Description: Datasheet; ComponentLink1URL: https://www.mouser.de/datasheet/2/585/MLCC-1837944.pdf; Component Type: Capacitor 0603; Device Package: 0603; Last Updated: 20/07/2022 09:55:05; Mounting Type: SMD; Operating Temperature: -55 - 125°C; Series: X7R; Supplier 1: Mouser; Supplier Part Number 1: 187-CL10B473KB8NNNC; Supplier 2: LCSC; Supplier Part Number 2: C1622; Type: Capacitor; Value: 47 nF; Live Cycle Status: 1; LCSC Part Number: C1622; Stock number: not stored
PS2 = TDK15-24D15W: Isolated Module DC DC Converter Buck 2 Output ±15V 500mA 9V~36V Input; Manufacturer: TDPOWER; Created from: TGaupp; Manufacturer Part Number: TDK15-24D15W; PartID: 26; Created On: 20/05/2026 14:56:35; ComponentLink1Description: Datasheet; ComponentLink1URL: https://www.lcsc.com/datasheet/C783530.pdf?spm=wm.sxq.inf.ggs___wm.fly.bg.0.xh&lcsc_vid=RlUMVwJUE1RdV1AHElFcBVIFQlFcAQcFQlFaAgcCR1gxVlNRTlNWVFZeR1NeXzsOAxUeFF5JWBYZEEoKFBINSQcJGk4NBhADEA4cHktXRlhXSQwSGg0%3D; Component Type: DC-DC Converters; Device Package: 25.4 mm x 25.4 mm x 11mm; Last Updated: 20/05/2026 15:16:51; Mounting Type: THT; Operating Temperature: -40℃~+85℃; Supplier 1: LCSC; Supplier Part Number 1: C783530; Type: DC-DC Converters; Live Cycle Status: 1; LCSC Part Number: C783530; Stock number: not stored

## Nets that join several sheets
24V_IN: Power_Supply_Signal_Conditioning (5 pins), PS_CT1 (C15_A.2 PS2_A.1), PS_CT2 (C15_B.2 PS2_B.1), PS_CT3 (C15_C.2 PS2_C.1), PS_CT4 (C15_D.2 PS2_D.1)
+5V_amp: Signal_Conditioning1 (C2_A.2 IC1_Signal_Conditioning1.3 IC1_Signal_Conditioning1.7), Signal_Conditioning2 (C2_B.2 IC1_Signal_Conditioning2.3 IC1_Signal_Conditioning2.7), Signal_Conditioning3 (C2_C.2 IC1_Signal_Conditioning3.3 IC1_Signal_Conditioning3.7), Signal_Conditioning4 (C2_D.2 IC1_Signal_Conditioning4.3 IC1_Signal_Conditioning4.7), Power_Supply_Signal_Conditioning (C7.2 C8.2 C9.2 PS1.6)
+15V1: DSub_Analog_Input (X1.9), PS_CT1 (C13_PS_CT1.2 C14_A.2 PS2_A.6)
+15V2: DSub_Analog_Input (X2.9), PS_CT2 (C13_PS_CT2.2 C14_B.2 PS2_B.6)
+15V3: DSub_Analog_Input (X3.9), PS_CT3 (C13_PS_CT3.2 C14_C.2 PS2_C.6)
+15V4: DSub_Analog_Input (X4.9), PS_CT4 (C13_PS_CT4.2 C14_D.2 PS2_D.6)
-5V_amp: Signal_Conditioning1 (C3_A.2 IC1_Signal_Conditioning1.6), Signal_Conditioning2 (C3_B.2 IC1_Signal_Conditioning2.6), Signal_Conditioning3 (C3_C.2 IC1_Signal_Conditioning3.6), Signal_Conditioning4 (C3_D.2 IC1_Signal_Conditioning4.6), Power_Supply_Signal_Conditioning (C10.1 C11.1 C12.1 PS1.4)
-15V1: DSub_Analog_Input (X1.5), PS_CT1 (C16_PS_CT1.1 C17_A.1 PS2_A.4)
-15V2: DSub_Analog_Input (X2.5), PS_CT2 (C16_PS_CT2.1 C17_B.1 PS2_B.4)
-15V3: DSub_Analog_Input (X3.5), PS_CT3 (C16_PS_CT3.1 C17_C.1 PS2_C.4)
-15V4: DSub_Analog_Input (X4.5), PS_CT4 (C16_PS_CT4.1 C17_D.1 PS2_D.4)
GND1: DSub_Analog_Input (X1.4 X1.M1 X1.M2), PS_CT1 (5 pins)
GND2: DSub_Analog_Input (X2.4 X2.M1 X2.M2), PS_CT2 (5 pins)
GND3: DSub_Analog_Input (X3.4 X3.M1 X3.M2), PS_CT3 (5 pins)
GND4: DSub_Analog_Input (X4.4 X4.M1 X4.M2), PS_CT4 (5 pins)
GND_amp: Signal_Conditioning1 (C1_Signal_Conditioning1.1 C2_A.1 C3_A.1), Signal_Conditioning2 (C1_Signal_Conditioning2.1 C2_B.1 C3_B.1), Signal_Conditioning3 (C1_Signal_Conditioning3.1 C2_C.1 C3_C.1), Signal_Conditioning4 (C1_Signal_Conditioning4.1 C2_D.1 C3_D.1), Power_Supply_Signal_Conditioning (7 pins)
GND_IN: Power_Supply_Signal_Conditioning (7 pins), PS_CT1 (C15_A.1 PS2_A.2), PS_CT2 (C15_B.1 PS2_B.2), PS_CT3 (C15_C.1 PS2_C.2), PS_CT4 (C15_D.1 PS2_D.2)
A_OUT_N1: Signal_Conditioning1 (R4_Signal_Conditioning1.2), RJ45_Analog_Output (X5.A8)
A_OUT_N2: Signal_Conditioning2 (R4_Signal_Conditioning2.2), RJ45_Analog_Output (X5.A5)
A_OUT_N3: Signal_Conditioning3 (R4_Signal_Conditioning3.2), RJ45_Analog_Output (X5.A6)
A_OUT_N4: Signal_Conditioning4 (R4_Signal_Conditioning4.2), RJ45_Analog_Output (X5.A2)
A_OUT_P1: Signal_Conditioning1 (R6_Signal_Conditioning1.2), RJ45_Analog_Output (X5.A7)
A_OUT_P2: Signal_Conditioning2 (R6_Signal_Conditioning2.2), RJ45_Analog_Output (X5.A4)
A_OUT_P3: Signal_Conditioning3 (R6_Signal_Conditioning3.2), RJ45_Analog_Output (X5.A3)
A_OUT_P4: Signal_Conditioning4 (R6_Signal_Conditioning4.2), RJ45_Analog_Output (X5.A1)
I_IN_AMP1: Signal_Conditioning1 (R2_Signal_Conditioning1.1 R3_A.2), DSub_Analog_Input (X1.6)
I_IN_AMP2: Signal_Conditioning2 (R2_Signal_Conditioning2.1 R3_B.2), DSub_Analog_Input (X2.6)
I_IN_AMP3: Signal_Conditioning3 (R2_Signal_Conditioning3.1 R3_C.2), DSub_Analog_Input (X3.6)
I_IN_AMP4: Signal_Conditioning4 (R2_Signal_Conditioning4.1 R3_D.2), DSub_Analog_Input (X4.6)
I_OUT_AMP1: Signal_Conditioning1 (R3_A.1 R5_Signal_Conditioning1.1), DSub_Analog_Input (X1.1)
I_OUT_AMP2: Signal_Conditioning2 (R3_B.1 R5_Signal_Conditioning2.1), DSub_Analog_Input (X2.1)
I_OUT_AMP3: Signal_Conditioning3 (R3_C.1 R5_Signal_Conditioning3.1), DSub_Analog_Input (X3.1)
I_OUT_AMP4: Signal_Conditioning4 (R3_D.1 R5_Signal_Conditioning4.1), DSub_Analog_Input (X4.1)